# Altium schematic sheet 刷卡面板.SchDoc
size A4
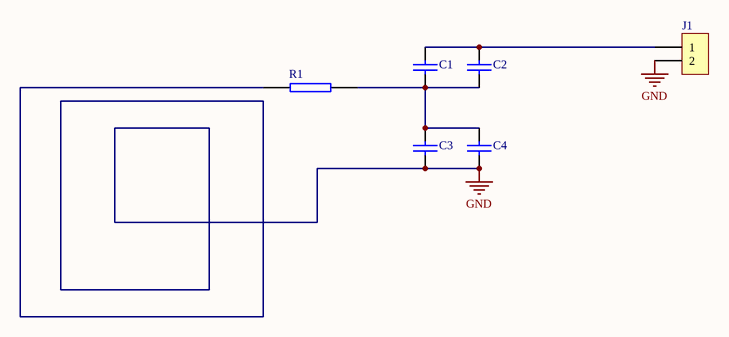
[diagram p0: 刷卡面板.SchDoc]

## Parts
C1  CAP  [0603_C]  (value not drawn)
C2  CAP  [0603_C]  (value not drawn)
C3  CAP  [0603_C]  (value not drawn)
C4  CAP  [0603_C]  (value not drawn)
J1  CON2  [sip2]  (value not drawn)
R1  RES2  [0603]  (value not drawn)

## Nets
GND: C3.2 C4.2 J1.2 R1.1
NetC1_1: C1.1 C2.1 J1.1
NetC1_2: C1.2 C2.2 C3.1 C4.1 R1.2

## Library data of the parts
C1-C4 = CAP: Capacitor
J1 = CON2: Connector